# Altium schematic sheet Interface.SchDoc: Interface
size A3; DrawnBy: Adrien Dos SANTOS; Organization: Altium Limited; Revision: REV 1.0; SheetNumber: 1; SheetTotal: 5; ProjectName: projname
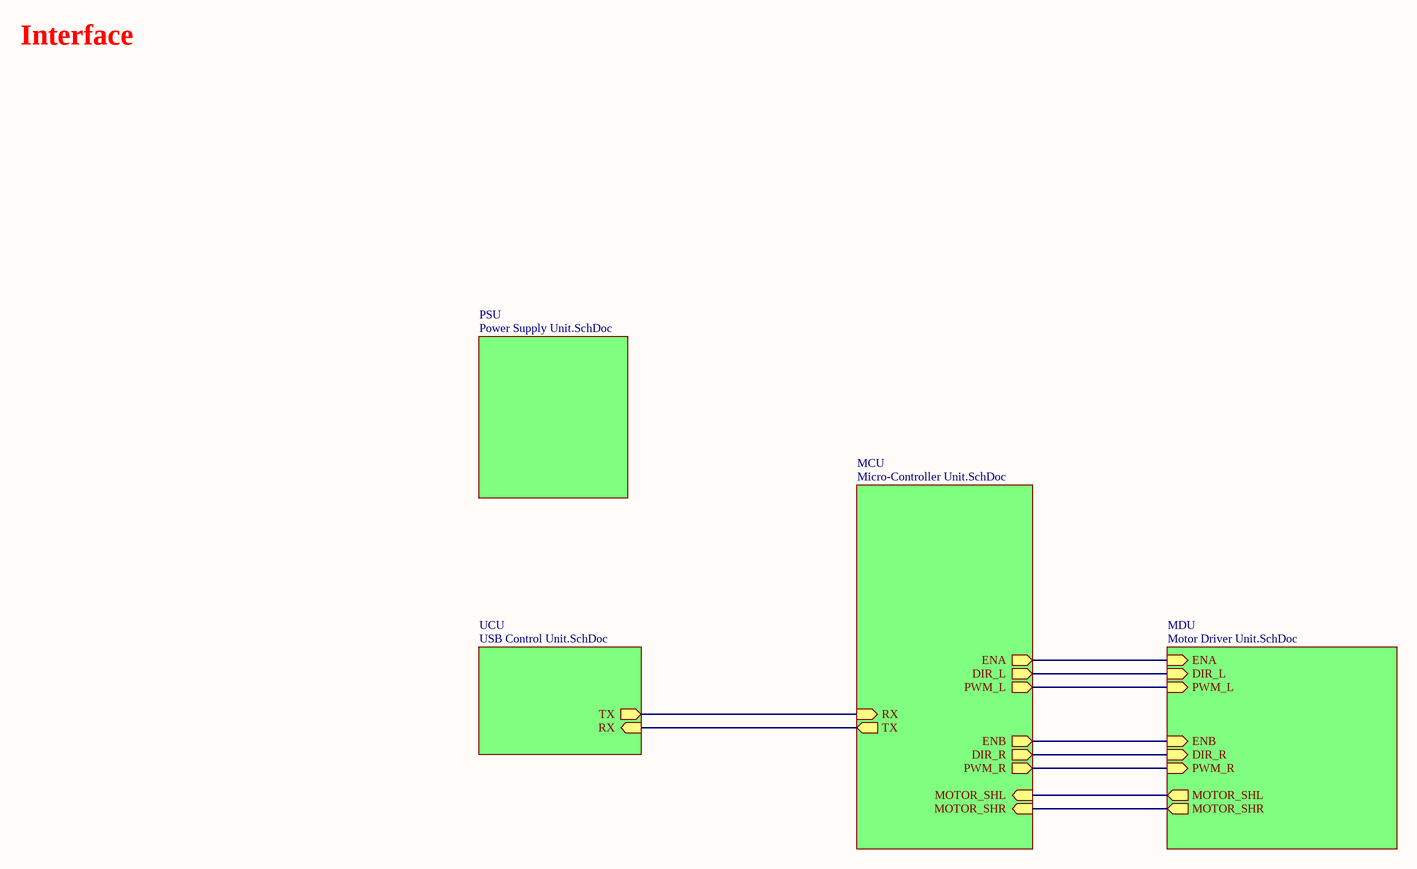
[diagram p0: Interface.SchDoc]

## Sub-sheets
MCU = Micro-Controller Unit.SchDoc: RX (in), TX (out), DIR_L (out), PWM_L (out), DIR_R (out), PWM_R (out), MOTOR_SHL (in), MOTOR_SHR (in), ENA (out), ENB (out)
MDU = Motor Driver Unit.SchDoc: DIR_L (in), PWM_L (in), DIR_R (in), PWM_R (in), MOTOR_SHL (out), MOTOR_SHR (out), ENA (in), ENB (in)
PSU = Power Supply Unit.SchDoc: no entries
UCU = USB Control Unit.SchDoc: TX (out), RX (in)

## Nets
(unnamed): sheet UCU/TX, sheet MCU/RX
(unnamed): sheet UCU/RX, sheet MCU/TX
(unnamed): sheet MCU/DIR_L, sheet MDU/DIR_L
(unnamed): sheet MCU/PWM_L, sheet MDU/PWM_L
(unnamed): sheet MCU/DIR_R, sheet MDU/DIR_R
(unnamed): sheet MCU/PWM_R, sheet MDU/PWM_R
(unnamed): sheet MCU/MOTOR_SHL, sheet MDU/MOTOR_SHL
(unnamed): sheet MCU/MOTOR_SHR, sheet MDU/MOTOR_SHR
(unnamed): sheet MCU/ENA, sheet MDU/ENA
(unnamed): sheet MCU/ENB, sheet MDU/ENB

## Notes on the sheet
- Interface
- Title
- Size:
- Date:
- A3
- Revision:
- Time:
- Sheet
- of
- Avnet EMG France SA
- 12 rue Jean Bart
- 91120 MASSY - FR
- File:
- Drawn by :